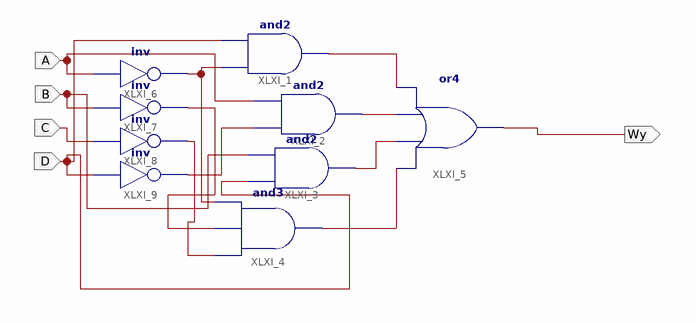
[diagram p0: schematic sheet 1]
// Xilinx ISE schematic zad2_schemat.sch (artix7) as structural Verilog: 9 symbols, 5 ports
module zad2_schemat (
  input  A,
  input  B,
  input  C,
  input  D,
  output Wy
);

  wire XLXN_24, XLXN_25, XLXN_27, XLXN_28, XLXN_29, XLXN_30, XLXN_31, XLXN_33;

  and XLXI_1 (XLXN_29, XLXN_24, D);
  and XLXI_2 (XLXN_30, XLXN_25, A);
  and XLXI_3 (XLXN_31, D, B);
  and XLXI_4 (XLXN_33, XLXN_28, XLXN_27, XLXN_24);
  or XLXI_5 (Wy, XLXN_33, XLXN_31, XLXN_30, XLXN_29);
  not XLXI_6 (XLXN_24, A);
  not XLXI_7 (XLXN_27, B);
  not XLXI_8 (XLXN_28, C);
  not XLXI_9 (XLXN_25, D);
endmodule
